# EAGLE design Barebones TQFP32 (EAGLE 7.6.0)
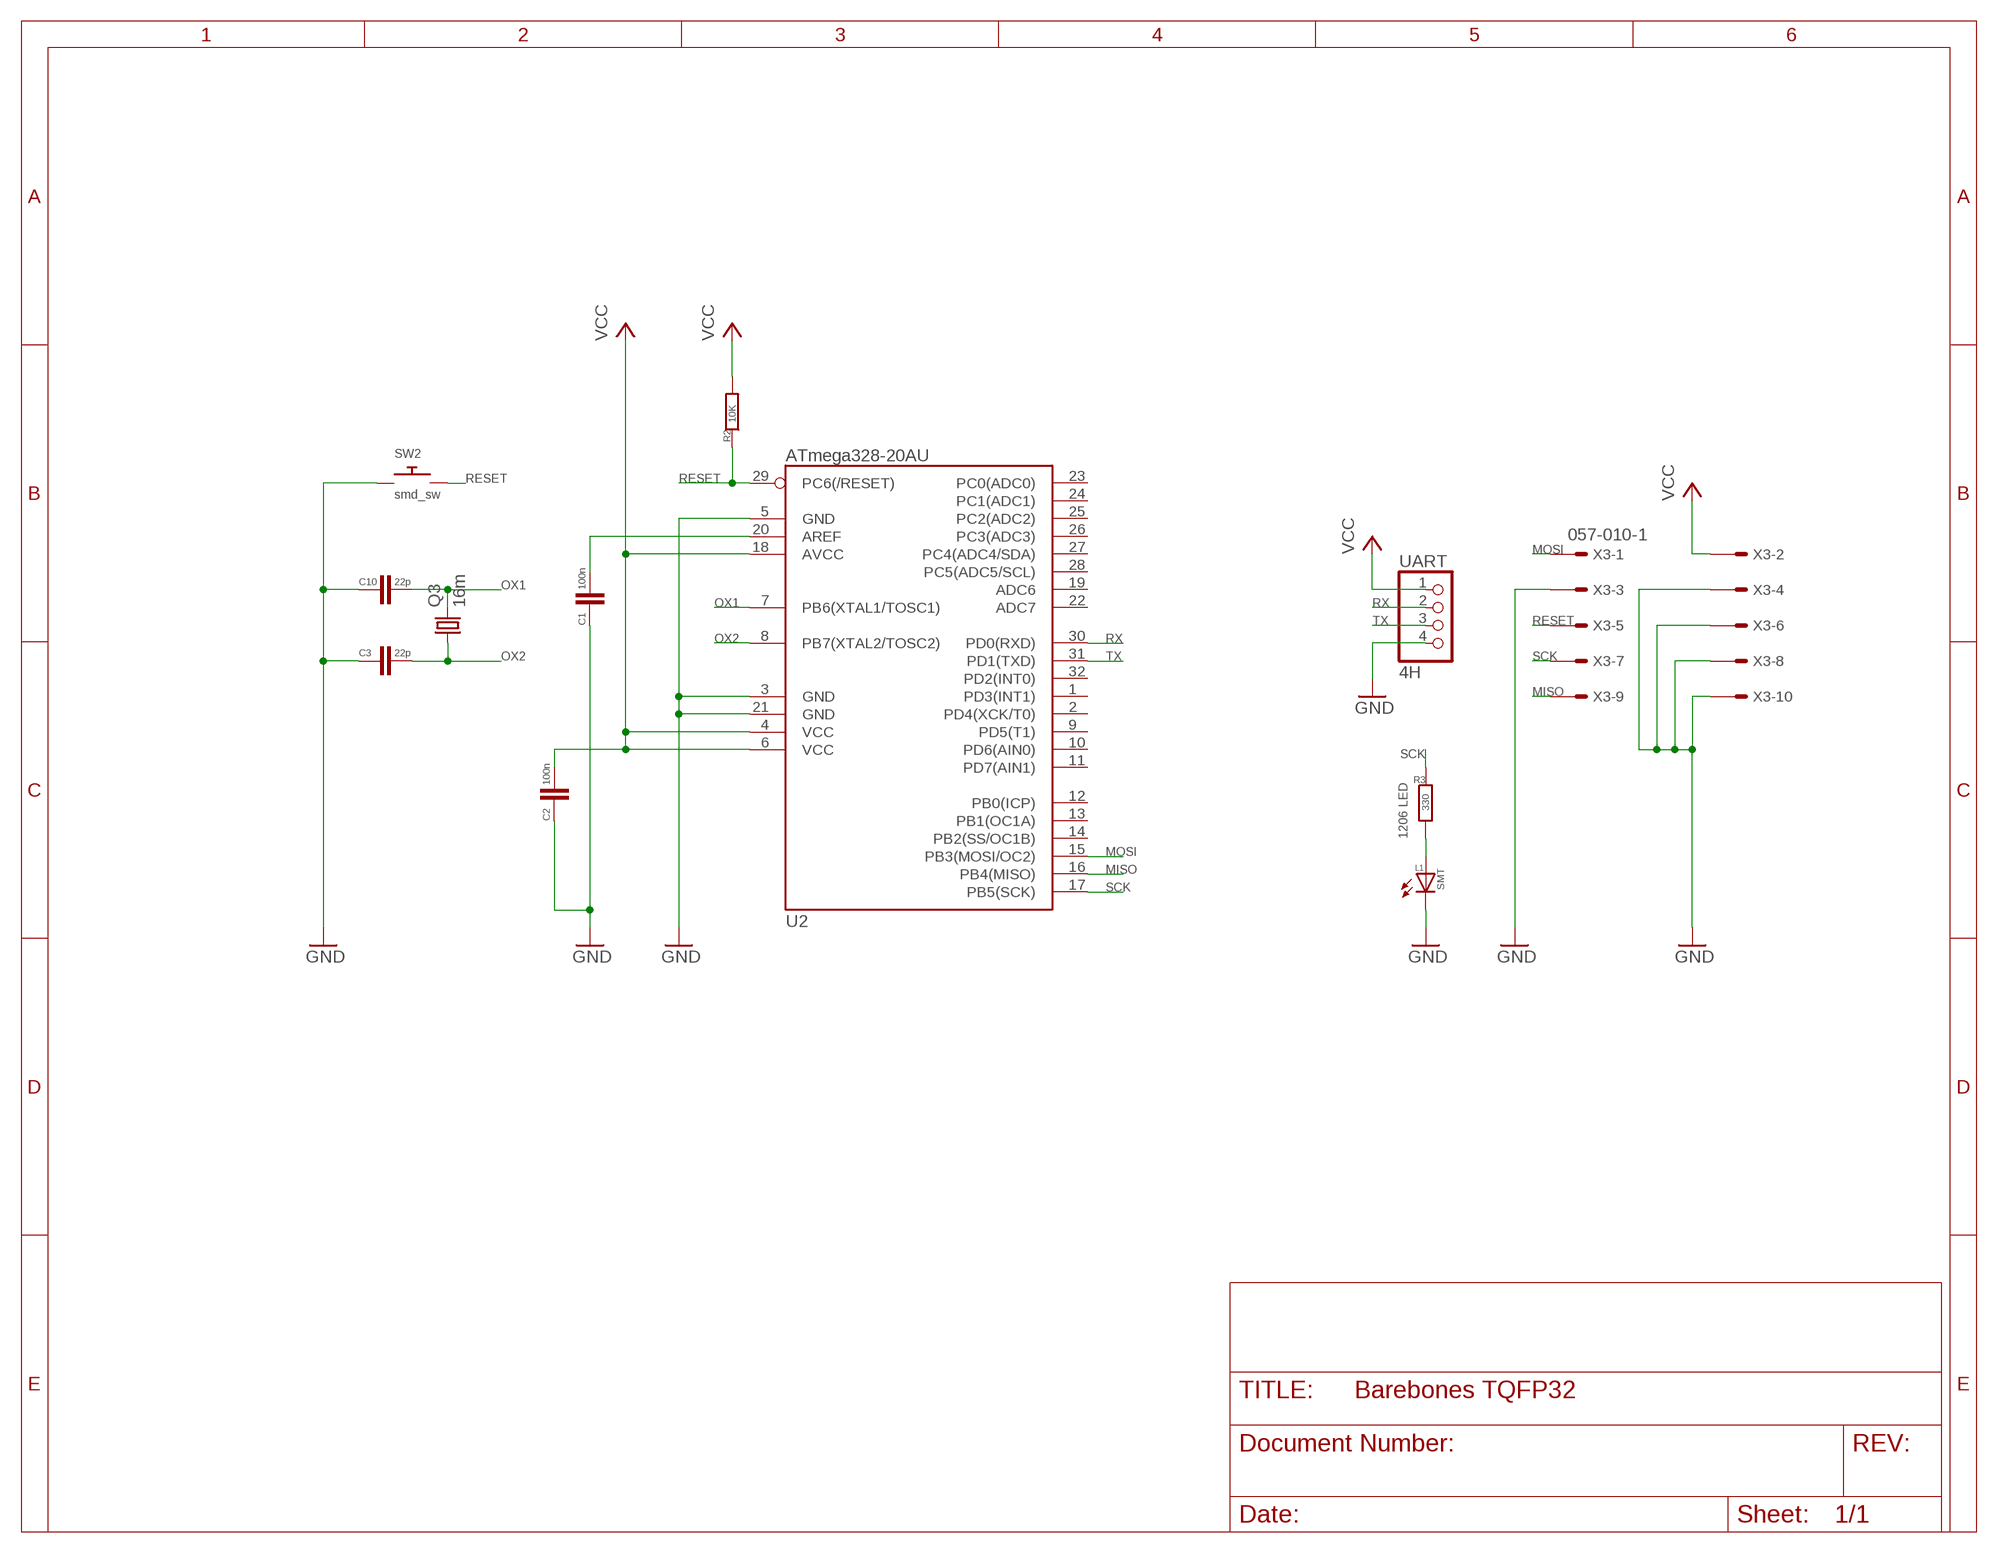
[diagram p0: schematic, sheet 1]

## Parts
C1  100n  C-EUC1206  [C1206]
C2  100n  C-EUC1206  [C1206]
C3  22p  C-EUC1206  [C1206]
C10  22p  C-EUC1206  [C1206]
L1  SMT  LEDSMT1206  [1206]
Q3  16m  CRYSTALHC49UP  [HC49UP]
R2  10K  R-EU_R1206  [R1206]
R3  330  R-EU_R1206  [R1206]
SW2  smd_sw  SWITCH_PUSHBUTTONEVQ-PE  [TACT_PANA-EVQ]
U2  ATmega328-20AU  ATMEGA168  [TQFP32]
UART  4H  PINHD-1X4  [1X04]
X3  057-010-1  [057-010-1]

## Nets
GND: C1.1 C2.1 C3.1 C10.1 L1.C SW2.P$1 U2.3(GND) U2.5(GND) U2.21(GND) UART.4 X3.3 X3.4 X3.6 X3.8 X3.10
MISO: U2.16(PB4(MISO)) X3.9
MOSI: U2.15(PB3(MOSI/OC2)) X3.1
N$1: C1.2 U2.20(AREF)
N$2: L1.A R3.2
OX1: C10.2 Q3.2 U2.7(PB6(XTAL1/TOSC1))
OX2: C3.2 Q3.1 U2.8(PB7(XTAL2/TOSC2))
RESET: R2.1 SW2.P$2 U2.29(PC6(/RESET)) X3.5
RX: U2.30(PD0(RXD)) UART.2
SCK: R3.1 U2.17(PB5(SCK)) X3.7
TX: U2.31(PD1(TXD)) UART.3
VCC: C2.2 R2.2 U2.4(VCC) U2.6(VCC) U2.18(AVCC) UART.1 X3.2
Unconnected: U2.1(PD3(INT1)) U2.2(PD4(XCK/T0)) U2.9(PD5(T1)) U2.10(PD6(AIN0)) U2.11(PD7(AIN1)) U2.12(PB0(ICP)) U2.13(PB1(OC1A)) U2.14(PB2(SS/OC1B)) U2.19(ADC6) U2.22(ADC7) U2.23(PC0(ADC0)) U2.24(PC1(ADC1)) U2.25(PC2(ADC2)) U2.26(PC3(ADC3)) U2.27(PC4(ADC4/SDA)) U2.28(PC5(ADC5/SCL)) U2.32(PD2(INT0))

## Notes on the sheet
- 1206 LED

## Library data of the parts
C1-C3 C10 = resistor:C-EU: CAPACITOR, European symbol
L1 = adafruit:LED: LED OSRAM: - CHIPLED LG R971, LG N971, LY N971, LG Q971, LY Q971, LO R971, LY R971 LH N974, LH R974 LS Q976, LO Q976, LY Q976 LO Q996 - Hyper CHIPLED LW Q18S LB Q993, LB Q99A, LB R99A - SideLED LS A670, LO A670, LY A670, LG A670, LP A670 LB A673, LV A673, LT A673, LW A673 LH A674 LY A675 LS A676, LA A676, LO A676, LY A676, LW A676 LS A679, LY A679, LG A679 - Hyper Micro SIDELED® LS Y876, LA Y876, LO Y876, LY Y876 LT Y87S - SmartLED LW L88C, LW L88S LB L89C, LB L89S, LG L890 LS L89K, LO L89K, LY L89K LS L896, LA L896, LO L896, LY L896 - TOPLED LS T670, LO T670, LY T670, LG T670, LP T670 LSG T670, LSP T670, LSY T670, LOP T670, LYG T670 LG T671, LOG T671, LSG T671 LB T673, LV T673, LT T673, LW T673 LH T674 LS T676, LA T676, LO T676, LY T676, LB T676, LH T676, LSB T676, LW T676 LB T67C, LV T67C, LT T67C, LS T67K, LO T67K, LY T67K, LW E67C LS E67B, LA E67B, LO E67B, LY E67B, LB E67C, LV E67C, LT E67C LW T67C LS T679, LY T679, LG T679 LS T770, LO T770, LY T770, LG T770, LP T770 LB T773, LV T773, LT T773, LW T773 LH T774 LS E675, LA E675, LY E675, LS T675 LS T776, LA T776, LO T776, LY T776, LB T776 LHGB T686 LT T68C, LB T68C - Hyper Mini TOPLED® LB M676 - Mini TOPLED Santana® LG M470 LS M47K, LO M47K, LY M47K Source: http://www.osram.convergy.de/
Q3 = adafruit:CRYSTAL: CRYSTAL; OC_FARNELL: unknown; OC_NEWARK: unknown
R2 R3 = resistor:R-EU_: RESISTOR, European symbol
SW2 = adafruit:SWITCH_PUSHBUTTON: Buttons SOFTTOUCHSMD_SJ - Soft touch temporary push button (Super Junk Akihabara) Compatible with SKPMANE010 [Mouser: 688-SKPMAN] C&K_KSS = Digikey: KSS221GLFS
U2 = IC:ATMEGA168
UART = pinhead:PINHD-1X4: PIN HEADER
X3 = con-panduit:057-010-: CONNECTOR 10-pin series 057 contact pc board low profile headers; OC_FARNELL: unknown; OC_NEWARK: unknown

## Board
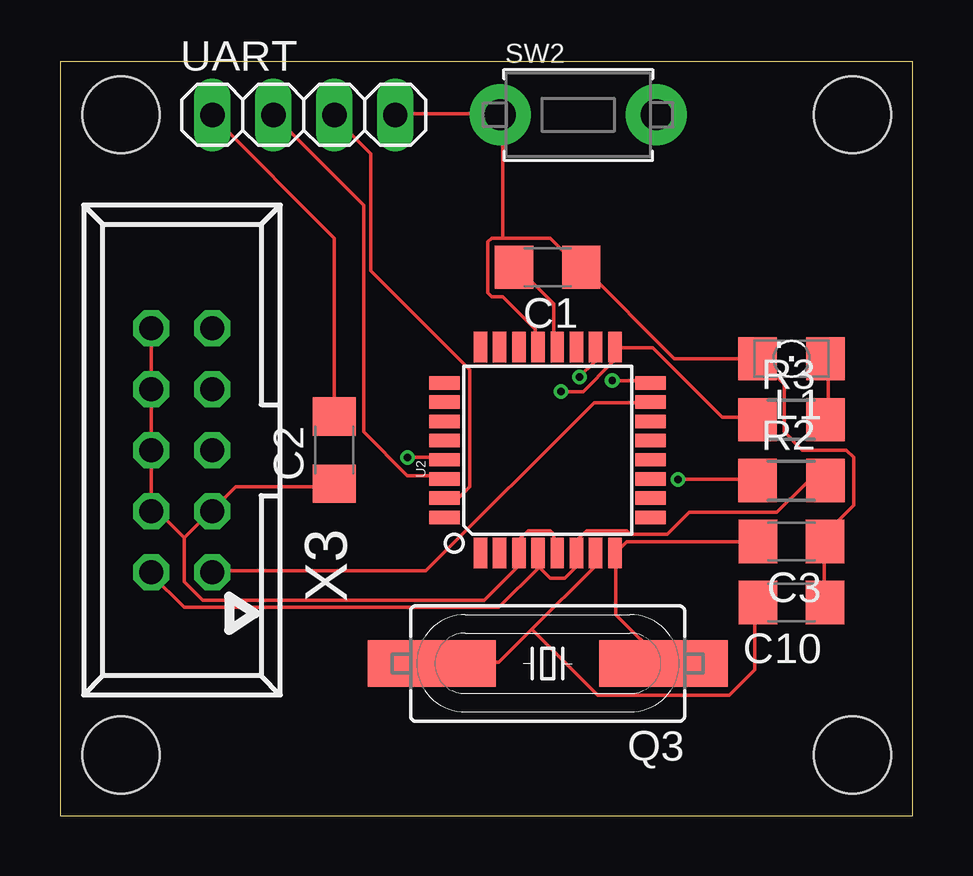
[diagram p1: board, top side]
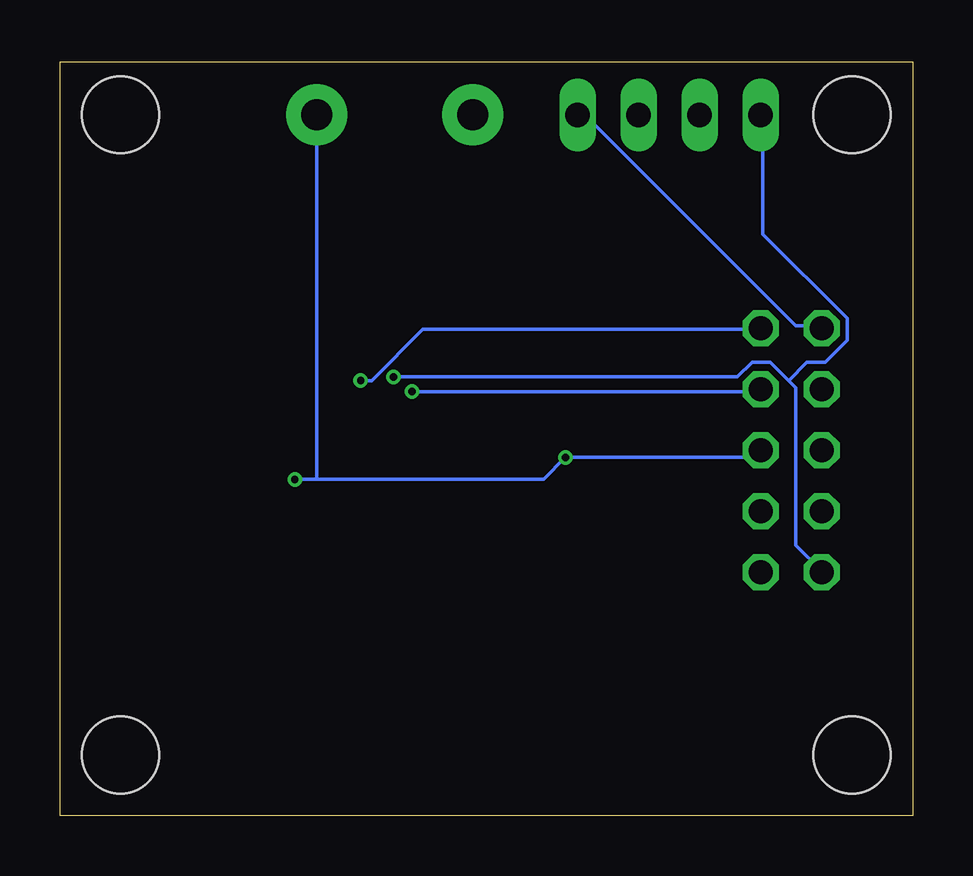
[diagram p2: board, bottom side, seen from below]

Size 35.54 x 31.42 mm. Coordinates in mm from the lower left corner, seen from the top.
Outline: 0,0 35.54,0 35.54,31.42 0,31.42 0,0
Copper layers (1*16): Top 0.035mm / dielectric 1.6mm / Bottom 0.035mm
Design rules "Elecrow_2-layer_PCB_eagle_rule": minimum track width 6mil, minimum drill 12mil, track to track 6mil, track to pad 8mil, pad to pad 12mil, via to via 12mil, smd to smd 0mil, copper to edge 20mil, drill to drill 10mil, minimum pad ring 6mil, minimum via ring 6mil, stop-mask expansion 0mil, vias tented up to drill 100mil, thermal gap 10mil
Holes 3.2 mm at 2.54,2.54 33.02,2.54 33.02,29.21 2.54,29.21

### Footprints (pad centres in the part's own frame; a part is rotated, then mirrored left to right if it is on the bottom)
C1206 = smd 1.6 x 1.8: 1 -1.4,0; 2 1.4,0
1206 = smd 1.6 x 1.803: A -1.422,0; C 1.422,0
HC49UP = smd 5.334 x 1.93: 1 -4.826,0; 2 4.826,0
R1206 = smd 1.6 x 1.803: 1 -1.422,0; 2 1.422,0
TACT_PANA-EVQ = drill 1.3 pad 2.54: P$1 -3.25,0; P$2 3.25,0
TQFP32 = smd 1.27 x 0.559: 1 -4.293,2.8; 2 -4.293,2; 3 -4.293,1.2; 4 -4.293,0.4; 5 -4.293,-0.4; 6 -4.293,-1.2; 7 -4.293,-2; 8 -4.293,-2.8; 17 4.293,-2.8; 18 4.293,-2; 19 4.293,-1.2; 20 4.293,-0.4; 21 4.293,0.4; 22 4.293,1.2; 23 4.293,2; 24 4.293,2.8 | smd 0.559 x 1.27: 9 -2.8,-4.293; 10 -2,-4.293; 11 -1.2,-4.293; 12 -0.4,-4.293; 13 0.4,-4.293; 14 1.2,-4.293; 15 2,-4.293; 16 2.8,-4.293; 25 2.8,4.293; 26 2,4.293; 27 1.2,4.293; 28 0.4,4.293; 29 -0.4,4.293; 30 -1.2,4.293; 31 -2,4.293; 32 -2.8,4.293
1X04 = drill 1.016 long: 1 -3.81,0; 2 -1.27,0; 3 1.27,0; 4 3.81,0
057-010-1 = drill 1 octagon: 1 -5.08,-1.27; 2 -5.08,1.27; 3 -2.54,-1.27; 4 -2.54,1.27; 5 0,-1.27; 6 0,1.27; 7 2.54,-1.27; 8 2.54,1.27; 9 5.08,-1.27; 10 5.08,1.27

### Placement (x,y rotation side)
C1  20.32,22.86 180 top
C2  11.43,15.24 90 top
C3  30.48,11.43 180 top
C10  30.48,8.89 180 top
L1  30.48,19.05 180 top
Q3  20.32,6.35 180 top
R2  30.48,13.97 0 top
R3  30.48,16.51 0 top
SW2  21.59,29.21 0 top
U2  20.32,15.24 90 top
UART  10.16,29.21 0 top
X3  5.08,15.24 90 top

### Tracks (layer width: path | path; a pad name or v marks a point on that pad's centre or on a via)
GND
  Top 0.152: X3.10 X3.8 X3.6 X3.4 3.81,12.65 4.12,12.65 5.18,11.58 | U2.5 20.57,10.97 20.57,11.73 20.42,11.89 19.51,11.89 19.2,11.58 19.2,10.97 U2.3 19.05,10.82 19.05,10.36 17.68,8.99 5.94,8.99 5.18,9.75 5.18,11.58 | C2.1 11.43,13.72 7.32,13.72 6.4,12.8 X3.3 6.25,12.65 5.18,11.58 | UART.4 14.02,29.26 18.29,29.26 SW2.P$1 18.44,29.11 18.44,24.08 | C10.1 31.85,8.99 31.85,11.43 C3.1 32,11.43 32,11.89 33.07,12.95 33.07,14.94 32.77,15.24 30.94,15.24 30.18,16 30.18,17.98 29.11,19.05 L1.C 25.6,19.05 21.79,22.86 C1.1 21.64,22.86 20.42,24.08 18.44,24.08 | 18.44,24.08 17.98,24.08 17.83,23.93 17.83,21.79 17.98,21.64 18.44,21.64 19.81,20.27 19.81,19.66 U2.21
  Bottom 0.152: X3.10 3.81,20.42 4.88,20.42 13.56,29.11 13.87,29.11 UART.4
MISO  (via drill 0.3)
  Top 0.152: v23.01,18.14 24.54,18.14 U2.16
  Bottom 0.152: v23.01,18.14 22.55,18.14 20.42,20.27 6.4,20.27 X3.9
MOSI
  Top 0.152: U2.15 24.54,17.22 22.25,17.22 15.24,10.21 6.4,10.21 X3.1
N$1
  Top 0.152: U2.20 20.57,19.66 20.57,21.34 19.05,22.86 C1.2
N$2
  Top 0.152: R3.2 32,16.61 32,19.05 L1.A
OX1
  Top 0.152: 19.66,7.77 18.29,6.4 15.54,6.4 Q3.2 | 19.66,7.77 22.25,10.36 22.25,10.82 U2.7 | 19.66,7.77 22.4,5.03 27.89,5.03 28.96,6.1 28.96,8.84 C10.2
OX2
  Top 0.152: Q3.1 25.15,6.4 23.16,8.38 23.16,10.82 U2.8 23.16,10.97 23.62,11.43 C3.2
RESET  (via drill 0.3)
  Top 0.152: v14.48,14.94 16,14.94 U2.29 | v25.76,14.02 28.96,14.02 R2.1
  Bottom 0.152: X3.5 6.4,15.24 6.71,14.94 v14.48,14.94 15.39,14.02 24.84,14.02 | 24.84,14.02 v25.76,14.02 | 24.84,14.02 24.84,29.11 SW2.P$2
RX
  Top 0.152: UART.2 12.65,25.45 12.65,16 14.48,14.17 16,14.17 U2.30
SCK  (via drill 0.3)
  Top 0.152: R3.1 28.96,16.61 27.58,16.61 24.69,19.51 23.16,19.51 U2.17 23.01,19.51 23.01,18.9 21.79,17.68 v20.88,17.68
  Bottom 0.152: v20.88,17.68 6.4,17.68 X3.7
TX
  Top 0.152: U2.31 16.15,13.26 16.61,13.26 17.07,13.72 17.07,18.59 12.95,22.71 12.95,27.58 11.43,29.11 UART.3
VCC  (via drill 0.3)
  Top 0.152: C2.2 11.43,24.08 6.4,29.11 UART.1 | 19.96,10.36 19.96,10.82 U2.4 19.96,10.36 | 19.96,10.36 20.42,9.91 21.03,9.91 21.49,10.36 21.49,10.82 U2.6 21.64,10.97 21.64,11.58 21.95,11.89 23.62,11.89 23.77,11.73 25.3,11.73 26.21,12.65 29.87,12.65 31.09,13.87 31.85,13.87 R2.2 | v21.64,18.29 22.25,18.9 22.25,19.51 U2.18 | 19.96,10.36 18.29,8.69 5.18,8.69 3.81,10.06 X3.2
  Bottom 0.152: v21.64,18.29 7.32,18.29 6.71,18.9 5.94,18.9 5.18,18.14 | 5.18,18.14 4.88,17.83 4.88,11.28 3.81,10.21 X3.2 | 5.18,18.14 4.42,18.9 3.66,18.9 2.74,19.81 2.74,20.73 6.25,24.23 6.25,29.11 UART.1